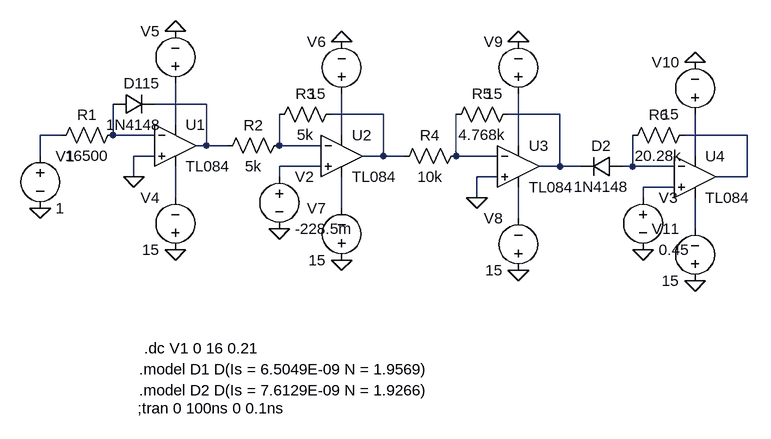
[diagram p0: schematic Draft1.asc]
Draft1.asc, the LTspice schematic file:
Version 4
SHEET 1 880 680
WIRE -48 80 -128 80
WIRE 224 96 144 96
WIRE 496 96 416 96
WIRE -96 112 -96 48
WIRE -272 128 -304 128
WIRE -192 128 -192 80
WIRE -128 128 -192 128
WIRE 160 128 160 64
WIRE 784 128 688 128
WIRE -48 144 -48 80
WIRE -48 144 -64 144
WIRE -16 144 -48 144
WIRE 64 144 64 96
WIRE 128 144 64 144
WIRE 432 144 432 64
WIRE -304 160 -304 128
WIRE -128 160 -160 160
WIRE 224 160 224 96
WIRE 224 160 192 160
WIRE 256 160 224 160
WIRE 336 160 336 96
WIRE 400 160 336 160
WIRE 704 160 704 96
WIRE 128 176 64 176
WIRE 496 176 496 96
WIRE 496 176 464 176
WIRE 528 176 496 176
WIRE 608 176 608 128
WIRE 608 176 592 176
WIRE 672 176 608 176
WIRE -160 192 -160 160
WIRE 64 192 64 176
WIRE 400 192 368 192
WIRE 784 192 784 128
WIRE 784 192 736 192
WIRE 672 208 624 208
WIRE -96 224 -96 176
WIRE 368 224 368 192
WIRE 624 224 624 208
WIRE 160 240 160 192
WIRE 432 256 432 208
WIRE 704 272 704 224
FLAG -304 240 0
FLAG -160 192 0
FLAG 64 272 0
FLAG 368 224 0
FLAG 624 304 0
FLAG -96 304 0
FLAG -96 -32 0
FLAG 160 320 0
FLAG 160 -16 0
FLAG 432 -16 0
FLAG 432 336 0
FLAG 704 352 0
FLAG 704 16 0
SYMBOL AutoGenerated\\TL084 -96 144 R0
SYMATTR InstName U1
SYMBOL AutoGenerated\\TL084 160 160 R0
SYMATTR InstName U2
SYMBOL AutoGenerated\\TL084 432 176 R0
SYMATTR InstName U3
SYMBOL AutoGenerated\\TL084 704 192 R0
SYMATTR InstName U4
SYMBOL diode -192 96 R270
WINDOW 0 32 32 VTop 2
WINDOW 3 0 32 VBottom 2
SYMATTR InstName D1
SYMATTR Value 1N4148
SYMBOL diode 592 160 R90
WINDOW 0 0 32 VBottom 2
WINDOW 3 32 32 VTop 2
SYMATTR InstName D2
SYMATTR Value 1N4148
SYMBOL res -176 112 R90
WINDOW 0 0 56 VBottom 2
WINDOW 3 32 56 VTop 2
SYMATTR InstName R1
SYMATTR Value 16500
SYMBOL res 80 128 R90
WINDOW 0 0 56 VBottom 2
WINDOW 3 32 56 VTop 2
SYMATTR InstName R2
SYMATTR Value 5k
SYMBOL res 160 80 R90
WINDOW 0 0 56 VBottom 2
WINDOW 3 32 56 VTop 2
SYMATTR InstName R3
SYMATTR Value 5k
SYMBOL res 352 144 R90
WINDOW 0 0 56 VBottom 2
WINDOW 3 32 56 VTop 2
SYMATTR InstName R4
SYMATTR Value 10k
SYMBOL res 432 80 R90
WINDOW 0 0 56 VBottom 2
WINDOW 3 32 56 VTop 2
SYMATTR InstName R5
SYMATTR Value 4.768k
SYMBOL res 704 112 R90
WINDOW 0 0 56 VBottom 2
WINDOW 3 32 56 VTop 2
SYMATTR InstName R6
SYMATTR Value 20.28k
SYMBOL voltage -304 144 R0
WINDOW 123 0 0 Left 0
WINDOW 39 0 0 Left 0
SYMATTR InstName V1
SYMATTR Value 1
SYMBOL voltage 64 176 R0
WINDOW 123 0 0 Left 0
WINDOW 39 0 0 Left 0
SYMATTR InstName V2
SYMATTR Value -228.5m
SYMBOL voltage 624 208 R0
WINDOW 123 0 0 Left 0
WINDOW 39 0 0 Left 0
SYMATTR InstName V3
SYMATTR Value 0.45
SYMBOL voltage -96 320 R180
WINDOW 0 24 96 Left 2
WINDOW 3 24 16 Left 2
WINDOW 123 0 0 Left 0
WINDOW 39 0 0 Left 0
SYMATTR InstName V4
SYMATTR Value 15
SYMBOL voltage -96 64 R180
WINDOW 0 24 96 Left 2
WINDOW 3 24 16 Left 2
WINDOW 123 0 0 Left 0
WINDOW 39 0 0 Left 0
SYMATTR InstName V5
SYMATTR Value 15
SYMBOL voltage 160 80 R180
WINDOW 0 24 96 Left 2
WINDOW 3 24 16 Left 2
WINDOW 123 0 0 Left 0
WINDOW 39 0 0 Left 0
SYMATTR InstName V6
SYMATTR Value 15
SYMBOL voltage 160 336 R180
WINDOW 0 24 96 Left 2
WINDOW 3 24 16 Left 2
WINDOW 123 0 0 Left 0
WINDOW 39 0 0 Left 0
SYMATTR InstName V7
SYMATTR Value 15
SYMBOL voltage 432 352 R180
WINDOW 0 24 96 Left 2
WINDOW 3 24 16 Left 2
WINDOW 123 0 0 Left 0
WINDOW 39 0 0 Left 0
SYMATTR InstName V8
SYMATTR Value 15
SYMBOL voltage 432 80 R180
WINDOW 0 24 96 Left 2
WINDOW 3 24 16 Left 2
WINDOW 123 0 0 Left 0
WINDOW 39 0 0 Left 0
SYMATTR InstName V9
SYMATTR Value 15
SYMBOL voltage 704 112 R180
WINDOW 0 24 96 Left 2
WINDOW 3 24 16 Left 2
WINDOW 123 0 0 Left 0
WINDOW 39 0 0 Left 0
SYMATTR InstName V10
SYMATTR Value 15
SYMBOL voltage 704 368 R180
WINDOW 0 24 96 Left 2
WINDOW 3 24 16 Left 2
WINDOW 123 0 0 Left 0
WINDOW 39 0 0 Left 0
SYMATTR InstName V11
SYMATTR Value 15
TEXT -152 488 Left 2 !.model D1 D(Is = 6.5049E-09 N = 1.9569)
TEXT -152 520 Left 2 !.model D2 D(Is = 7.6129E-09 N = 1.9266)
TEXT -154 548 Left 2 !;tran 0 100ns 0 0.1ns
TEXT -144 456 Left 2 !.dc V1 0 16 0.21

The netlist it stands for:
* Draft1.asc
* U1: TL084 (symbol AutoGenerated\TL084 not available, pins judged from their places): In+=0 In-=N006 V+=N004 V-=N016 OUT=N001
* U2: TL084 (symbol AutoGenerated\TL084 not available, pins judged from their places): In+=N013 In-=N009 V+=N007 V-=N017 OUT=N002
* U3: TL084 (symbol AutoGenerated\TL084 not available, pins judged from their places): In+=0 In-=N011 V+=N010 V-=N018 OUT=N003
* U4: TL084 (symbol AutoGenerated\TL084 not available, pins judged from their places): In+=N015 In-=N014 V+=N012 V-=N019 OUT=N008
D1 N006 N001 1N4148
D2 N014 N003 1N4148
R1 N006 N005 16500
R2 N009 N001 5k
R3 N002 N009 5k
R4 N011 N002 10k
R5 N003 N011 4.768k
R6 N008 N014 20.28k
V1 N005 0 1
V2 N013 0 -228.5m
V3 N015 0 0.45
V4 0 N016 15
V5 N004 0 15
V6 N007 0 15
V7 0 N017 15
V8 0 N018 15
V9 N010 0 15
V10 N012 0 15
V11 0 N019 15
.model D D
.lib standard.dio
.model D1 D(Is = 6.5049E-09 N = 1.9569)
.model D2 D(Is = 7.6129E-09 N = 1.9266)
;tran 0 100ns 0 0.1ns
.dc V1 0 16 0.21
.backanno
.end